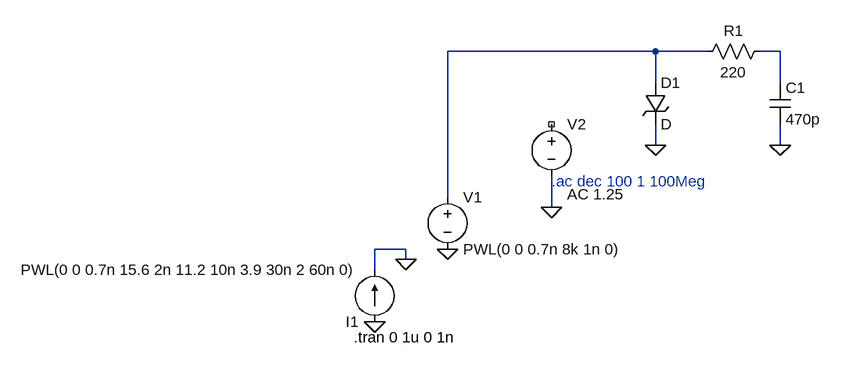
[diagram p0: schematic Design2_1_25_Vinpp_R220_C470p.asc]
Design2_1_25_Vinpp_R220_C470p.asc, the LTspice schematic file:
Version 4.1
SHEET 1 1404 680
WIRE 240 48 -80 48
WIRE 320 48 240 48
WIRE 432 48 400 48
WIRE 240 96 240 48
WIRE 432 96 432 48
WIRE 240 192 240 160
WIRE 432 192 432 160
WIRE -80 272 -80 48
WIRE 80 288 80 240
WIRE -144 352 -192 352
WIRE -144 368 -144 352
WIRE -192 384 -192 352
FLAG 240 192 0
FLAG 432 192 0
FLAG -192 464 0
FLAG -80 352 0
FLAG 80 288 0
FLAG -144 368 0
SYMBOL TVSdiode 224 96 R0
SYMATTR InstName D1
SYMBOL res 416 32 R90
WINDOW 0 0 56 VBottom 2
WINDOW 3 32 56 VTop 2
SYMATTR InstName R1
SYMATTR Value 220
SYMBOL cap 416 96 R0
SYMATTR InstName C1
SYMATTR Value 470p
SYMBOL current -192 464 R180
WINDOW 123 0 0 Left 0
WINDOW 39 0 0 Left 0
SYMATTR InstName I1
SYMATTR Value PWL(0 0 0.7n 15.6 2n 11.2 10n 3.9 30n 2 60n 0)
SYMBOL voltage -80 256 R0
WINDOW 123 0 0 Left 0
WINDOW 39 0 0 Left 0
SYMATTR InstName V1
SYMATTR Value PWL(0 0 0.7n 8k 1n 0)
SYMBOL voltage 80 144 R0
WINDOW 123 24 124 Left 2
WINDOW 39 0 0 Left 0
SYMATTR InstName V2
SYMATTR Value ""
SYMATTR Value2 AC 1.25
TEXT -224 488 Left 2 !.tran 0 1u 0 1n
TEXT 80 248 Left 2 ;.ac dec 100 1 100Meg

The netlist it stands for:
* Design2_1_25_Vinpp_R220_C470p.asc
D1 N001 0 D
R1 N002 N001 220
C1 N002 0 470p
I1 0 0 PWL(0 0 0.7n 15.6 2n 11.2 10n 3.9 30n 2 60n 0)
V1 N001 0 PWL(0 0 0.7n 8k 1n 0)
V2 NC_01 0 AC 1.25
.model D D
.lib standard.dio
.tran 0 1u 0 1n
* .ac dec 100 1 100Meg
.backanno
.end